# EAGLE design sch_temperatura (EAGLE 9.6.2)
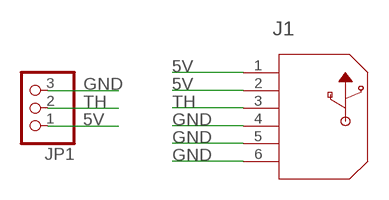
[diagram p0: schematic, sheet 1]

## Parts
J1  292303-3  [CONN4_292303_TEC]
JP1  PINHD-1X3  [1X03]

## Nets
5V: J1.1 J1.2 JP1.1
GND: J1.4 J1.5 J1.6 JP1.3
TH: J1.3 JP1.2

## Library data of the parts
J1 = USB_A_TH:292303-3; BUILT_BY: EMA_UL_Team; COPYRIGHT: Copyright (C) 2016 Accelerated Designs. All rights reserved; DESCRIPTION: USB A R/A RCPT ASSY THRU HOLE, LEAD FREE; MANUFACTURER_PART_NUMBER: 292303-3; PITCH_MM_: 2.5; POSITIONS: 4; PRODUCT: Connector; ROWS-CONFIG: 1; SOURCELIBRARY: TE_Connectivity-2018-03-16; TE_PART_NUMBER: 292303-3; TYPE: USB 2.0; VENDOR: TE Connectivity
JP1 = adafruit:PINHD-1X3: PIN HEADER

## Board
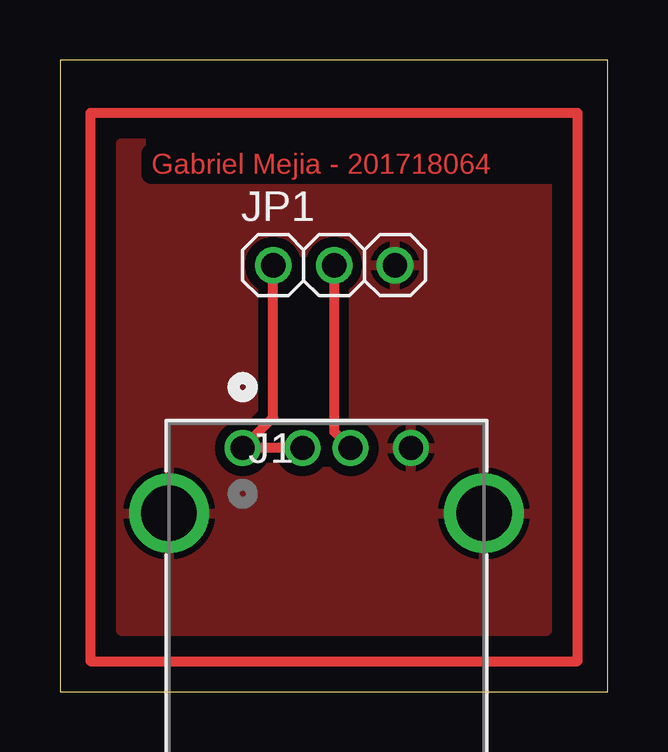
[diagram p1: board, top side]
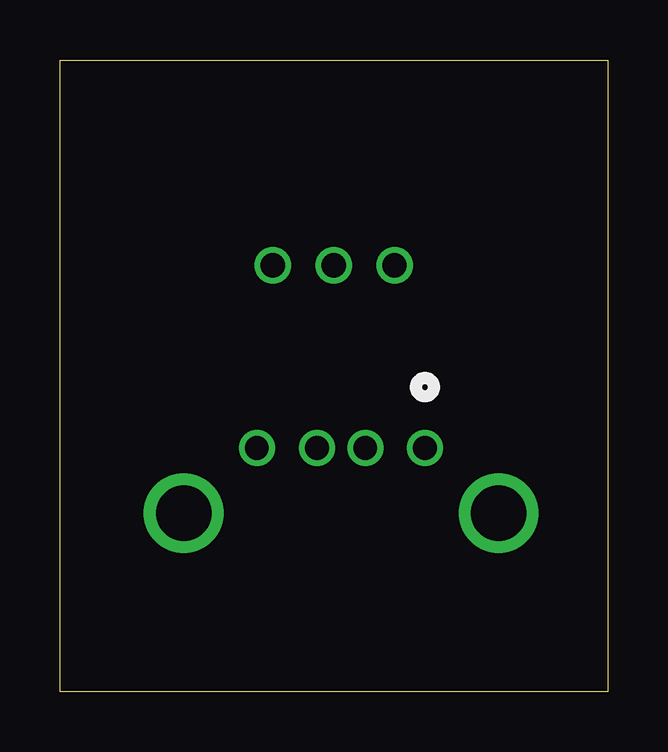
[diagram p2: board, bottom side, seen from below]

Size 22.84 x 26.34 mm. Coordinates in mm from the lower left corner, seen from the top.
Outline: 0,0 22.84,0 22.84,26.34 0,26.34 0,0
Copper layers (1*16): Top 0.035mm / dielectric 1.5mm / Bottom 0.035mm
Design rules "default": minimum track width 6mil, minimum drill 0.35mm, track to track 6mil, track to pad 6mil, pad to pad 6mil, via to via 6mil, smd to smd 6mil, copper to edge 40mil, drill to drill 6mil, minimum pad ring 10mil, minimum via ring 8mil, stop-mask expansion 4mil, vias tented up to drill 0mil, thermal gap 10mil

### Footprints (pad centres in the part's own frame; a part is rotated, then mirrored left to right if it is on the bottom)
CONN4_292303_TEC = drill 0.991 pad 1.499: 1 0,0; 2 2.489,0; 3 4.496,0; 4 7.01,0 | drill 2.311 pad 2.819: 5 -3.073,-2.718; 6 10.058,-2.718
1X03 = drill 1.016: 1 -2.54,0; 2 0,0; 3 2.54,0

### Placement (x,y rotation side)
J1  7.62,10.16 0 top
JP1  11.43,17.78 0 top

### Tracks (layer width: path | path; a pad name or v marks a point on that pad's centre or on a via)
5V
  Top 0.152: J1.1 7.64,10.18
  Top 0.406: J1.2 J1.1 8.89,11.43 JP1.1
GND
  pour Top (isolate 0.406): 2.54,22.86 2.54,2.54 20.32,2.54 20.32,22.86
N$1
  Top 0.406: 1.27,1.27 21.59,1.27 21.59,24.13 1.27,24.13 1.27,1.27
TH
  Top 0.406: JP1.2 11.43,10.85 J1.3

### Text on the board
Top: Gabriel Mejia - 201718064